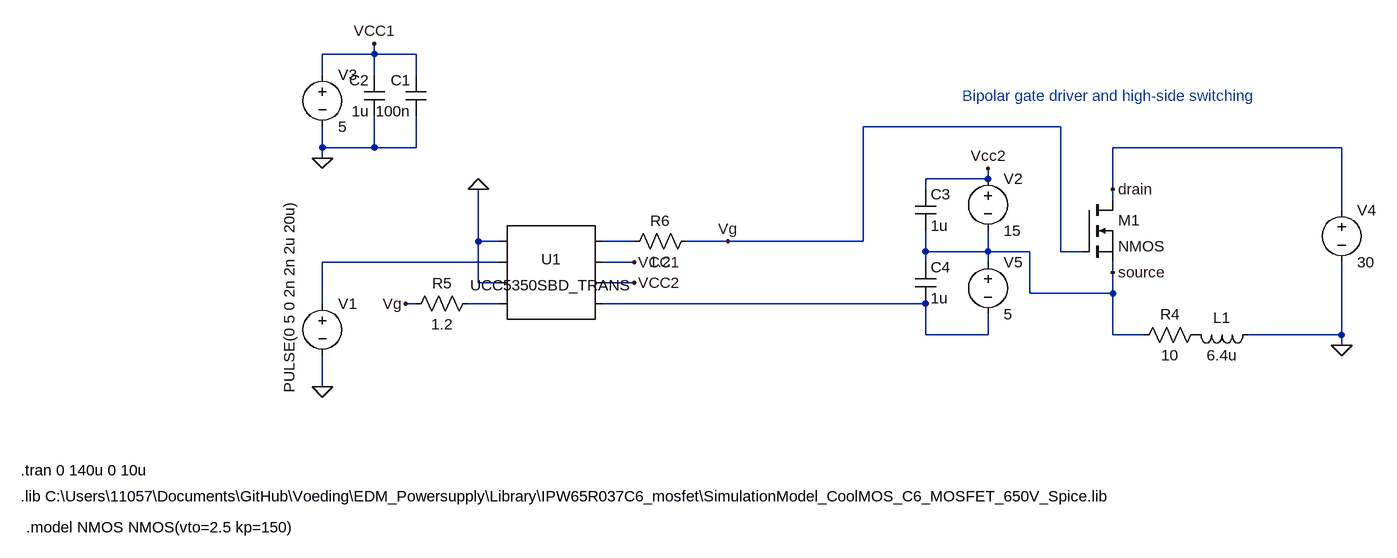
[diagram p0: schematic EDM_Powersupply_V5.asc]
EDM_Powersupply_V5.asc, the LTspice schematic file:
Version 4
SHEET 1 1356 680
WIRE -176 -160 -176 -176
WIRE -176 -160 -256 -160
WIRE -112 -160 -176 -160
WIRE -256 -128 -256 -160
WIRE -176 -128 -176 -160
WIRE -112 -128 -112 -160
WIRE 880 -48 576 -48
WIRE -256 -16 -256 -48
WIRE -176 -16 -176 -64
WIRE -176 -16 -256 -16
WIRE -112 -16 -112 -64
WIRE -112 -16 -176 -16
WIRE 1312 -16 960 -16
WIRE -256 0 -256 -16
WIRE 768 32 768 16
WIRE 768 32 672 32
WIRE 672 48 672 32
WIRE 960 48 960 -16
WIRE 960 64 960 48
WIRE 1312 80 1312 -16
WIRE -16 128 -16 48
WIRE 16 128 -16 128
WIRE 224 128 176 128
WIRE 368 128 304 128
WIRE 576 128 576 -48
WIRE 576 128 368 128
WIRE 672 144 672 112
WIRE 768 144 768 112
WIRE 768 144 672 144
WIRE 832 144 768 144
WIRE 880 144 880 -48
WIRE 912 144 880 144
WIRE 16 160 -256 160
WIRE 224 160 176 160
WIRE 672 160 672 144
WIRE 768 160 768 144
WIRE 960 176 960 160
WIRE -16 192 -16 128
WIRE 16 192 -16 192
WIRE 224 192 176 192
WIRE 832 208 832 144
WIRE 960 208 960 176
WIRE 960 208 832 208
WIRE -256 224 -256 160
WIRE -112 224 -128 224
WIRE 16 224 -32 224
WIRE 672 224 176 224
WIRE 672 272 672 224
WIRE 768 272 768 240
WIRE 768 272 672 272
WIRE 960 272 960 208
WIRE 1008 272 960 272
WIRE 1312 272 1312 160
WIRE 1312 272 1168 272
WIRE 1312 288 1312 272
WIRE -256 352 -256 304
FLAG -256 352 0
FLAG -256 0 0
FLAG 224 192 VCC2
FLAG 768 16 Vcc2
FLAG 224 160 VCC1
FLAG -176 -176 VCC1
FLAG 368 128 Vg
FLAG -128 224 Vg
FLAG -16 48 0
FLAG 960 48 drain
FLAG 960 176 source
FLAG 1312 288 0
SYMBOL AutoGenerated\\UCC5350SBD_TRANS 96 176 R0
SYMATTR InstName U1
SYMBOL voltage -256 208 R0
WINDOW 123 0 0 Left 0
WINDOW 39 0 0 Left 0
WINDOW 3 -51 153 VLeft 2
SYMATTR Value PULSE(0 5 0 2n 2n 2u 20u)
SYMATTR InstName V1
SYMBOL voltage 768 16 R0
WINDOW 123 0 0 Left 0
WINDOW 39 0 0 Left 0
SYMATTR InstName V2
SYMATTR Value 15
SYMBOL cap -96 -64 R180
WINDOW 0 24 56 Left 2
WINDOW 3 24 8 Left 2
SYMATTR InstName C1
SYMATTR Value 100n
SYMBOL cap -160 -64 R180
WINDOW 0 24 56 Left 2
WINDOW 3 24 8 Left 2
SYMATTR InstName C2
SYMATTR Value 1u
SYMBOL voltage -256 -144 R0
WINDOW 123 0 0 Left 0
WINDOW 39 0 0 Left 0
SYMATTR InstName V3
SYMATTR Value 5
SYMBOL res 992 288 R270
WINDOW 0 32 56 VTop 2
WINDOW 3 0 56 VBottom 2
SYMATTR InstName R4
SYMATTR Value 10
SYMBOL voltage 1312 64 R0
WINDOW 123 0 0 Left 0
WINDOW 39 0 0 Left 0
SYMATTR InstName V4
SYMATTR Value 30
SYMBOL res -16 208 R90
WINDOW 0 0 56 VBottom 2
WINDOW 3 32 56 VTop 2
SYMATTR InstName R5
SYMATTR Value 1.2
SYMBOL res 320 112 R90
WINDOW 0 0 56 VBottom 2
WINDOW 3 32 56 VTop 2
SYMATTR InstName R6
SYMATTR Value 1.2
SYMBOL nmos 912 64 R0
SYMATTR InstName M1
SYMBOL cap 656 48 R0
SYMATTR InstName C3
SYMATTR Value 1u
SYMBOL cap 656 160 R0
SYMATTR InstName C4
SYMATTR Value 1u
SYMBOL voltage 768 144 R0
WINDOW 123 0 0 Left 0
WINDOW 39 0 0 Left 0
SYMATTR InstName V5
SYMATTR Value 5
SYMBOL ind 1184 256 R90
WINDOW 0 5 56 VBottom 2
WINDOW 3 32 56 VTop 2
SYMATTR InstName L1
SYMATTR Value 6.4u
TEXT -720 520 Left 2 !.lib C:\\Users\\11057\\Documents\\GitHub\\Voeding\\EDM_Powersupply\\Library\\IPW65R037C6_mosfet\\SimulationModel_CoolMOS_C6_MOSFET_650V_Spice.lib
TEXT -720 480 Left 2 !.tran 0 140u 0 10u
TEXT -712 568 Left 2 !.model NMOS NMOS(vto=2.5 kp=150)
TEXT 728 -96 Left 2 ;Bipolar gate driver and high-side switching

The netlist it stands for:
* EDM_Powersupply_V5.asc
* U1: UCC5350SBD_TRANS (symbol AutoGenerated\UCC5350SBD_TRANS not available, pins judged from their places): pin1=0 pin2=N002 pin3=0 pin4=N003 pin5=N001 pin6=VCC1 pin7=VCC2 pin8=N004
V1 N002 0 PULSE(0 5 0 2n 2n 2u 20u)
V2 VCC2 source 15
C1 0 VCC1 100n
C2 0 VCC1 1u
V3 VCC1 0 5
R4 source P001 10
V4 drain 0 30
R5 N003 Vg 1.2
R6 Vg N001 1.2
M1 drain Vg source source NMOS
C3 VCC2 source 1u
C4 source N004 1u
V5 source N004 5
L1 0 P001 6.4u
.model NMOS NMOS
.model PMOS PMOS
.lib standard.mos
.lib C:\Users\11057\Documents\GitHub\Voeding\EDM_Powersupply\Library\IPW65R037C6_mosfet\SimulationModel_CoolMOS_C6_MOSFET_650V_Spice.lib
.tran 0 140u 0 10u
.model NMOS NMOS(vto=2.5 kp=150)
* Bipolar gate driver and high-side switching
.backanno
.end